# EAGLE design SenzorDPCutie (EAGLE 6.5.0)
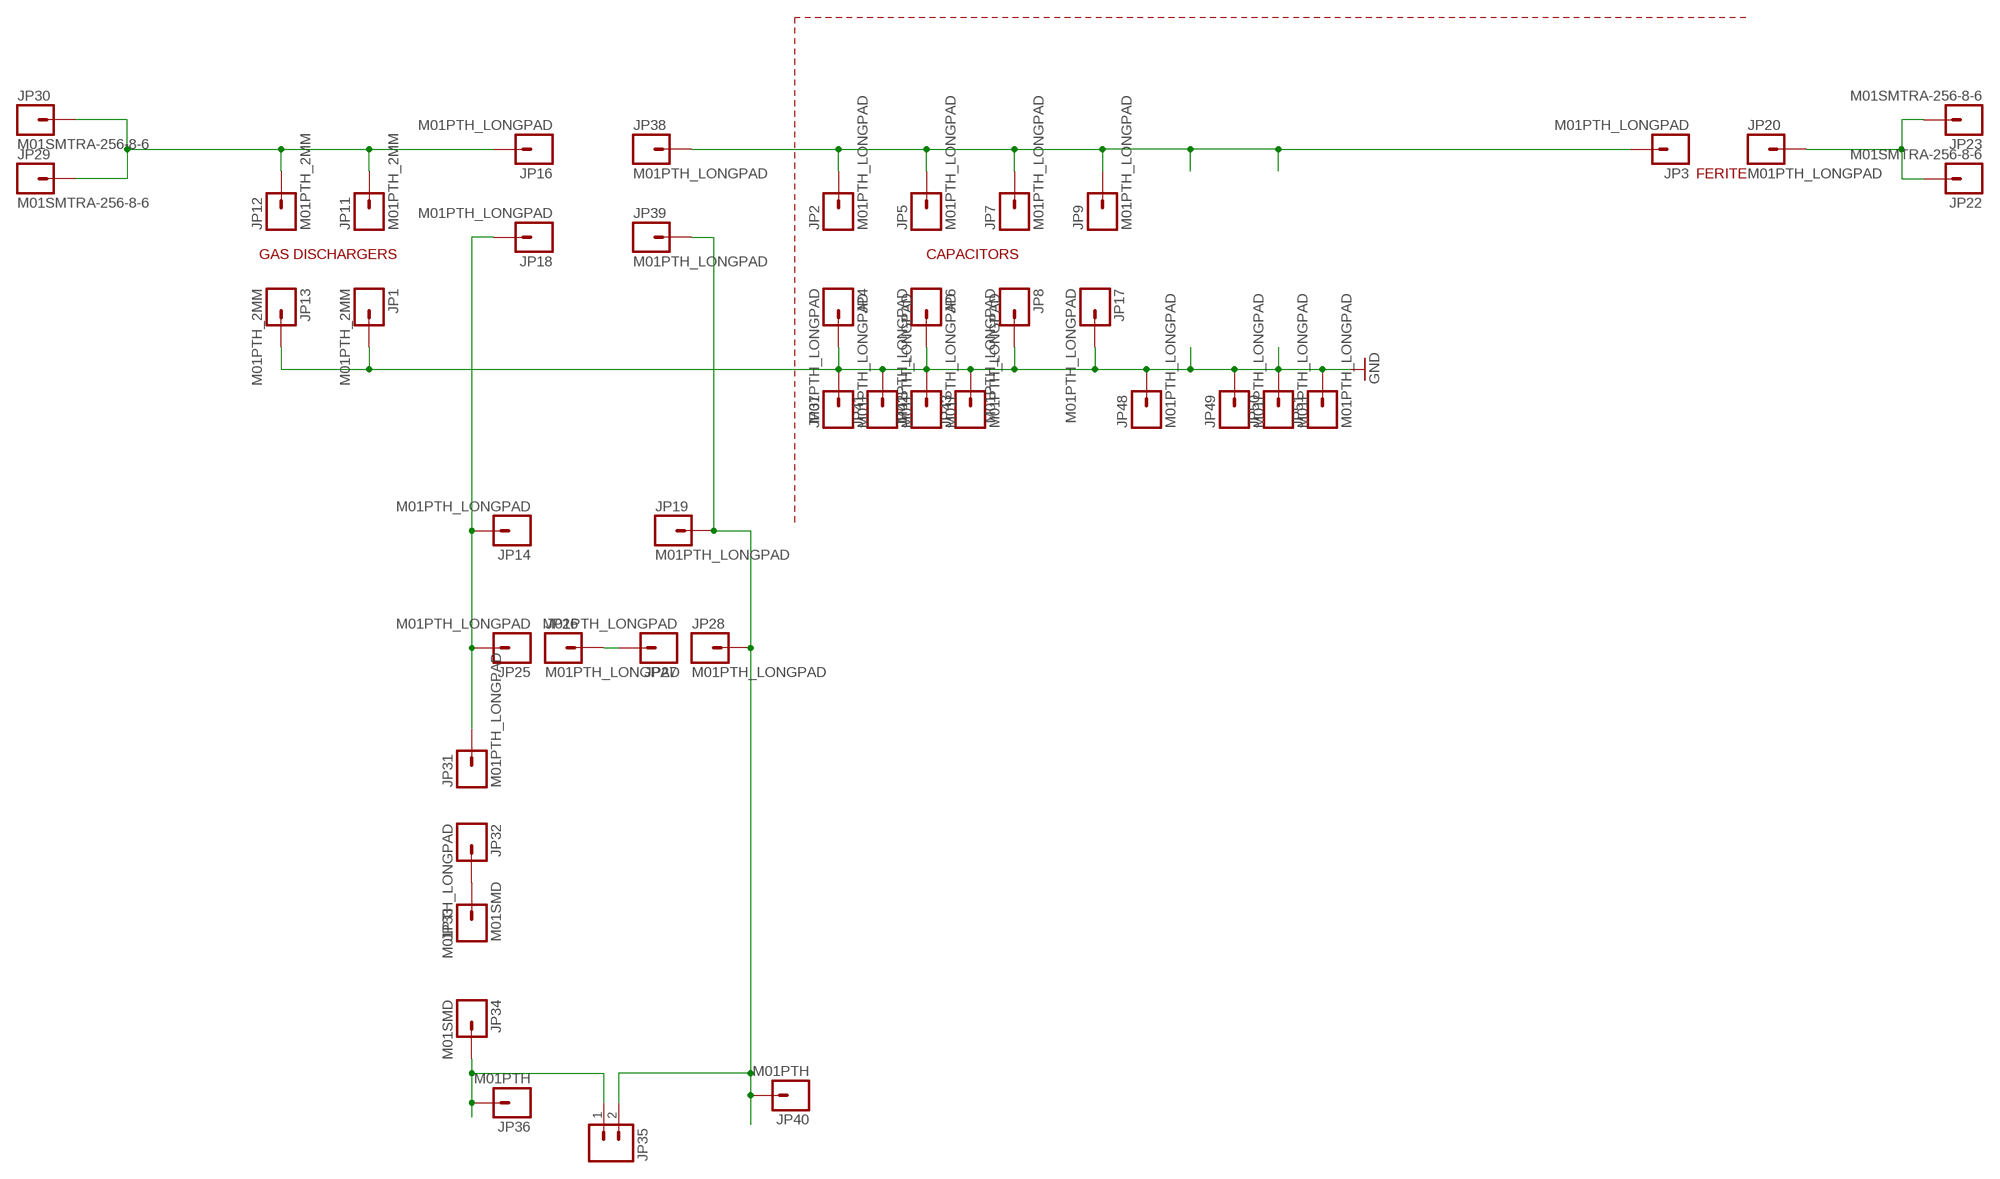
[diagram p0: schematic, sheet 1]

## Parts
JP1  M01PTH_2MM  [1X01_2MM]
JP2  M01PTH_LONGPAD  [1X01_LONGPAD]
JP3  M01PTH_LONGPAD  [1X01_LONGPAD]
JP4  M01PTH_LONGPAD  [1X01_LONGPAD]
JP5  M01PTH_LONGPAD  [1X01_LONGPAD]
JP6  M01PTH_LONGPAD  [1X01_LONGPAD]
JP7  M01PTH_LONGPAD  [1X01_LONGPAD]
JP8  M01PTH_LONGPAD  [1X01_LONGPAD]
JP9  M01PTH_LONGPAD  [1X01_LONGPAD]
JP11  M01PTH_2MM  [1X01_2MM]
JP12  M01PTH_2MM  [1X01_2MM]
JP13  M01PTH_2MM  [1X01_2MM]
JP14  M01PTH_LONGPAD  [1X01_LONGPAD]
JP16  M01PTH_LONGPAD  [1X01_LONGPAD]
JP17  M01PTH_LONGPAD  [1X01_LONGPAD]
JP18  M01PTH_LONGPAD  [1X01_LONGPAD]
JP19  M01PTH_LONGPAD  [1X01_LONGPAD]
JP20  M01PTH_LONGPAD  [1X01_LONGPAD]
JP22  M01SMTRA-256-8-6  [SMTRA-256-8-6]
JP23  M01SMTRA-256-8-6  [SMTRA-256-8-6]
JP25  M01PTH_LONGPAD  [1X01_LONGPAD]
JP26  M01PTH_LONGPAD  [1X01_LONGPAD]
JP27  M01PTH_LONGPAD  [1X01_LONGPAD]
JP28  M01PTH_LONGPAD  [1X01_LONGPAD]
JP29  M01SMTRA-256-8-6  [SMTRA-256-8-6]
JP30  M01SMTRA-256-8-6  [SMTRA-256-8-6]
JP31  M01PTH_LONGPAD  [1X01_LONGPAD]
JP32  M01PTH_LONGPAD  [1X01_LONGPAD]
JP33  M01SMD  [LUXEON-PAD]
JP34  M01SMD  [LUXEON-PAD]
JP35  M025MM  [SCREWTERMINAL-5MM-2]
JP36  M01PTH  [1X01]
JP37  M01PTH_LONGPAD  [1X01_LONGPAD]
JP38  M01PTH_LONGPAD  [1X01_LONGPAD]
JP39  M01PTH_LONGPAD  [1X01_LONGPAD]
JP40  M01PTH  [1X01]
JP41  M01PTH_LONGPAD  [1X01_LONGPAD]
JP42  M01PTH_LONGPAD  [1X01_LONGPAD]
JP43  M01PTH_LONGPAD  [1X01_LONGPAD]
JP48  M01PTH_LONGPAD  [1X01_LONGPAD]
JP49  M01PTH_LONGPAD  [1X01_LONGPAD]
JP50  M01PTH_LONGPAD  [1X01_LONGPAD]
JP51  M01PTH_LONGPAD  [1X01_LONGPAD]

## Nets
GND: JP1.1 JP4.1 JP6.1 JP8.1 JP13.1 JP17.1 JP37.1 JP41.1 JP42.1 JP43.1 JP48.1 JP49.1 JP50.1 JP51.1
N$1: JP20.1 JP22.P$1 JP23.P$1
N$2: JP26.1 JP27.1
N$4: JP32.1 JP33.P$1
N$5: JP34.P$1 JP35.1 JP36.1
N$8: JP2.1 JP3.1 JP5.1 JP7.1 JP9.1 JP38.1
N$9: JP14.1 JP18.1 JP25.1 JP31.1
N$10: JP19.1 JP28.1 JP35.2 JP39.1 JP40.1
SIG: JP11.1 JP12.1 JP16.1 JP29.P$1 JP30.P$1

## Notes on the sheet
- FERITE
- GAS DISCHARGERS | CAPACITORS

## Library data of the parts
JP1-JP9 JP11-JP14 JP16-JP20 JP22 JP23 JP25-JP34 JP36-JP43 JP48-JP51 = SparkFun-Connectors:M01: Header 1 Standard 1-pin 0.1" header. Use with straight break away headers (SKU : PRT-00116), right angle break away headers (PRT-00553), swiss pins (PRT-00743), machine pins (PRT-00117), and female headers (PRT-00115).
JP35 = SparkFun-Connectors:M02: Header 2 Standard 2-pin 0.1" header. Use with straight break away headers (SKU : PRT-00116), right angle break away headers (PRT-00553), swiss pins (PRT-00743), machine pins (PRT-00117), and female headers (PRT-00115). Molex polarized connector foot print use with SKU : PRT-08233 with associated crimp pins and housings.

## Board
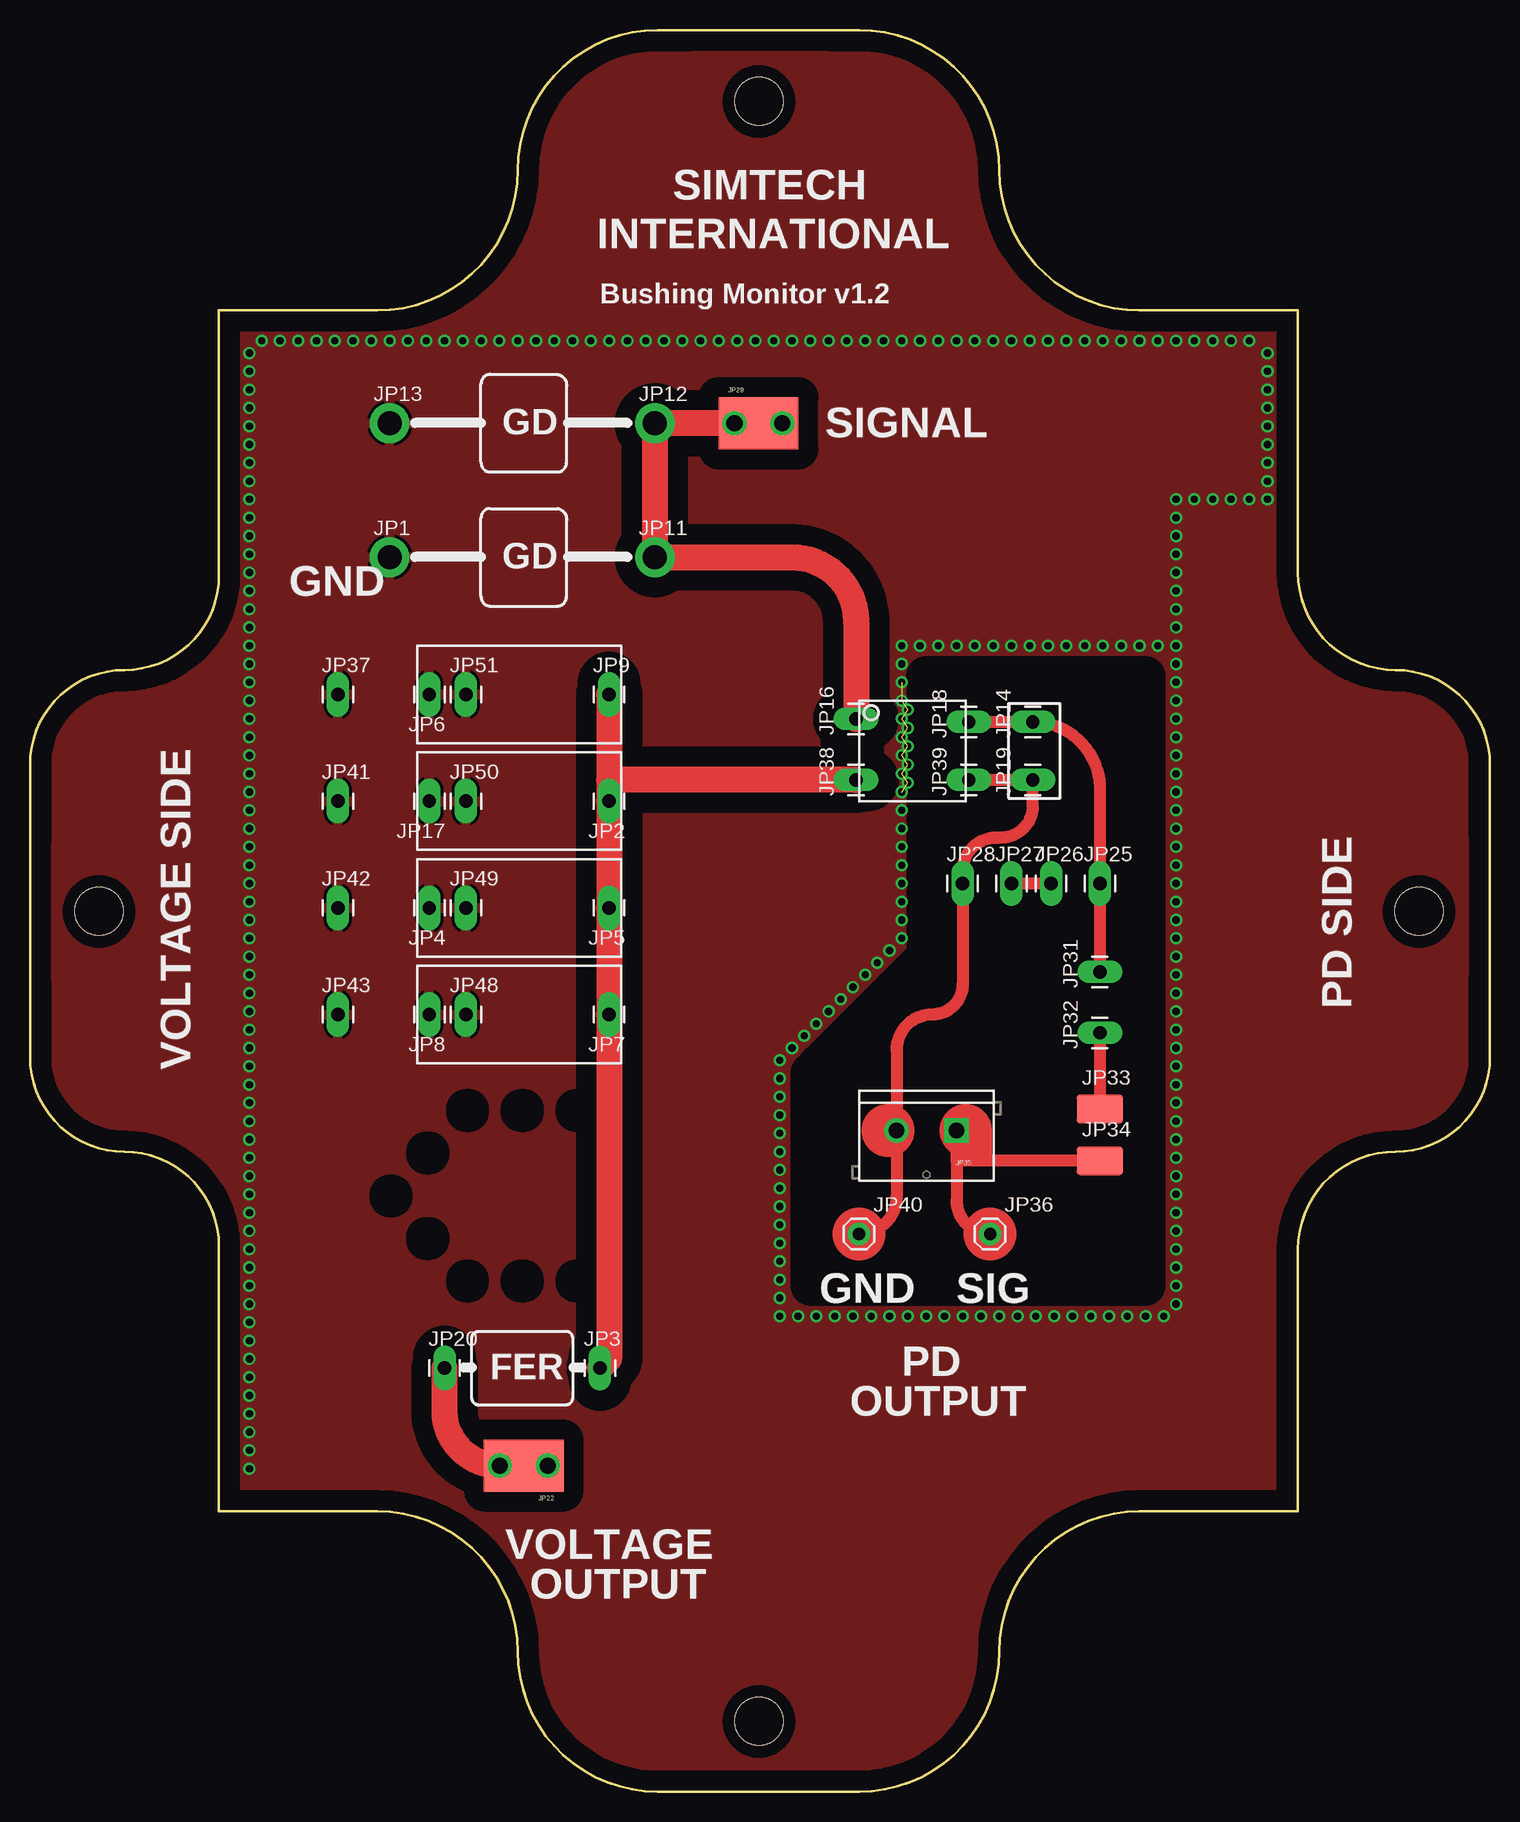
[diagram p1: board, top side]
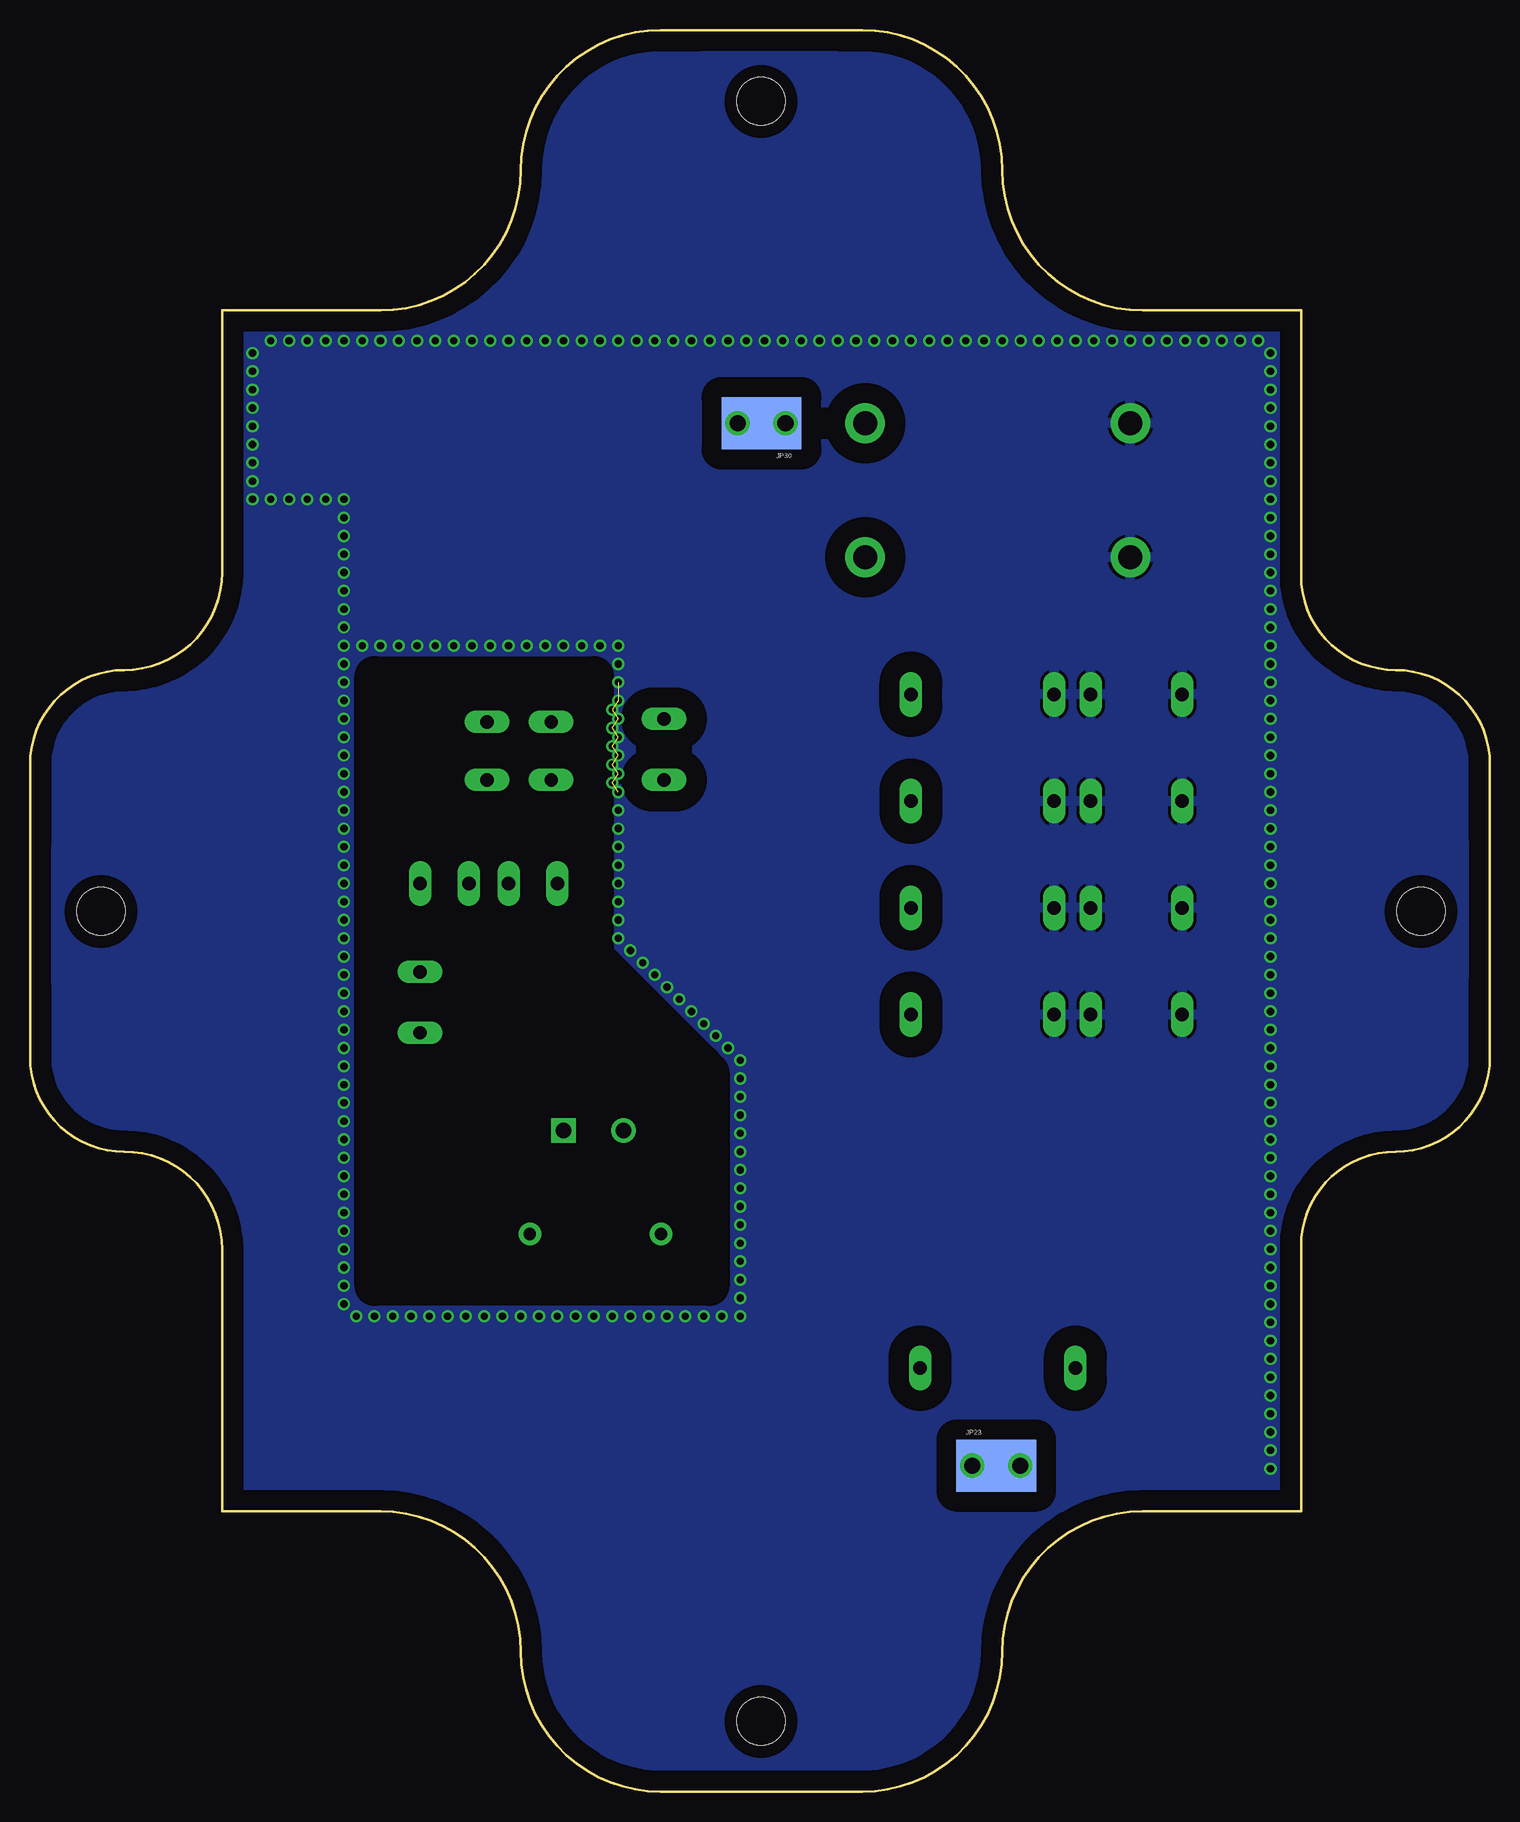
[diagram p2: board, bottom side, seen from below]

Size 121.67 x 146.81 mm. Coordinates in mm from the lower left corner, seen from the top.
Outline: 15.75,123.44 28.96,123.44 arc90 40.64,135.13 arc-90 52.32,146.81 69.09,146.81 arc-90 80.77,135.13 arc90 92.46,123.44 105.66,123.44 105.66,101.6 arc90 113.79,93.47 arc-90 121.67,85.6 121.67,61.21 arc-90 113.79,53.34 arc90 105.66,45.21 105.66,23.37 92.46,23.37 arc90 80.77,11.68 arc-90 69.09,0 52.32,0 arc-90 40.64,11.68 arc90 28.96,23.37 15.75,23.37 15.75,45.47 arc90 7.87,53.34 arc-90 0,61.21 0,85.6 arc-90 7.87,93.47 arc90 15.75,101.35 15.75,123.44
Copper layers (1*16): Top 0.035mm / dielectric 1.5mm / Bottom 0.035mm
Design rules "default *": minimum track width 10mil, minimum drill 24mil, track to track 8mil, track to pad 8mil, pad to pad 8mil, via to via 8mil, smd to smd 8mil, copper to edge 40mil, drill to drill 8mil, minimum pad ring 10mil, minimum via ring 8mil, stop-mask expansion 4mil, vias tented up to drill 0mil, thermal gap 10mil
Holes 4 mm at 60.75,140.87 5.75,73.37 115.75,73.37 60.75,5.87
tRestrict: area 65,42.2 to 93,59.9; area 74.7,58.9 to 93,93; area 33,53.1 to 33.3,53.3; area 36.3,56.6 to 36.6,56.9; area 40.9,56.6 to 41.1,56.9; area 45.5,56.6 to 45.7,56.9; area 40.9,42.4 to 41.1,42.7; area 45.5,42.4 to 45.7,42.7; area 36.3,42.4 to 36.6,42.7; area 33,46 to 33.3,46.2; area 30,49.5 to 30.2,49.8; 1 lines
bRestrict: area 65,42.2 to 93,59.9; area 74.7,58.9 to 93,93; 1 lines

### Footprints (pad centres in the part's own frame; a part is rotated, then mirrored left to right if it is on the bottom)
1X01_2MM = drill 2 pad 3.302: 1 0,0
1X01_LONGPAD = drill 1.118 pad 1.88 long: 1 0,0
SMTRA-256-8-6 = drill 1.346: P$1 -1.994,0; P$2 1.994,0 | smd 6.655 x 4.343: P$3 0,0
LUXEON-PAD = smd 3.9 x 2.4: P$1 0,0
SCREWTERMINAL-5MM-2 = drill 1.3 pad 2.032 square: 1 0,0 | drill 1.3 pad 2.032: 2 5,0
1X01 = drill 1.016 pad 1.88: 1 0,0

### Placement (x,y rotation side)
JP1  29.97,102.87 0 top
JP2  48.26,82.55 180 top
JP3  47.5,35.31 0 top
JP4  33.27,73.66 180 top
JP5  48.26,73.66 180 top
JP6  33.27,91.44 180 top
JP7  48.26,64.77 180 top
JP8  33.27,64.77 180 top
JP9  48.26,91.44 0 top
JP11  52.07,102.87 0 top
JP12  52.07,114.05 0 top
JP13  29.97,114.05 0 top
JP14  83.57,89.15 90 top
JP16  68.83,89.41 90 top
JP17  33.27,82.55 180 top
JP18  78.23,89.15 90 top
JP19  83.57,84.33 90 top
JP20  34.54,35.31 0 top
JP22  41.15,27.18 180 top
JP23  41.15,27.18 0 bottom
JP25  89.15,75.69 0 top
JP26  85.09,75.69 0 top
JP27  81.79,75.69 0 top
JP28  77.72,75.69 0 top
JP29  60.71,114.05 0 top
JP30  60.71,114.05 180 bottom
JP31  89.15,68.33 90 top
JP32  89.15,63.25 90 top
JP33  89.15,56.9 0 top
JP34  89.15,52.58 0 top
JP35  77.22,55.12 180 top
JP36  80.01,46.48 0 top
JP37  25.65,91.44 0 top
JP38  68.83,84.33 90 top
JP39  78.23,84.33 90 top
JP40  69.09,46.48 0 top
JP41  25.65,82.55 0 top
JP42  25.65,73.66 0 top
JP43  25.65,64.77 0 top
JP48  36.32,64.77 0 top
JP49  36.32,73.66 0 top
JP50  36.32,82.55 0 top
JP51  36.32,91.44 0 top

### Tracks (layer width: path | path; a pad name or v marks a point on that pad's centre or on a via)
GND  (via drill 0.6)  (11 unrouted)
  other vias: 62.48,39.62 62.48,41.15 62.48,42.67 62.48,44.2 62.48,45.72 62.48,47.24 62.48,48.77 72.64,81.79 72.64,83.31 72.64,84.84 72.64,86.36 72.64,87.88 72.64,89.41 72.64,90.93 72.64,92.46 72.64,93.98 72.64,95.5 95.5,42.16 95.5,43.69 95.5,45.21 95.5,46.74 95.5,48.26 95.5,49.78 95.5,51.31 95.5,52.83 95.5,54.36 95.5,55.88 95.5,57.4 95.5,58.93 95.5,60.45 95.5,61.98 95.5,63.5 95.5,65.02 95.5,66.55 95.5,68.07 95.5,69.6 95.5,71.12 95.5,72.64 95.5,74.17 95.5,75.69 95.5,77.22 95.5,78.74 95.5,80.26 95.5,81.79 95.5,83.31 95.5,84.84 95.5,86.36 95.5,87.88 95.5,89.41 95.5,90.93 95.5,92.46 95.5,93.98 95.5,95.5 95.5,97.03 95.5,98.55 95.5,40.64 80.77,39.62 83.82,39.62 88.39,39.62 94.49,39.62 91.44,39.62 89.92,39.62 86.87,39.62 79.25,39.62 82.3,39.62 85.34,39.62 92.96,39.62 68.58,67.06 69.6,68.07 70.61,69.09 71.63,70.1 74.17,95.5 97.03,107.7 75.69,95.5 77.22,95.5 78.74,95.5 80.26,95.5 81.79,95.5 83.31,95.5 84.84,95.5 86.36,95.5 87.88,95.5 89.41,95.5 90.93,95.5 92.46,95.5 93.98,95.5 95.5,107.7 95.5,100.08 95.5,101.6 95.5,103.12 95.5,104.65 103.12,107.7 95.5,106.17 98.55,107.7 100.08,107.7 101.6,107.7 18.29,42.16 18.29,43.69 18.29,45.21 18.29,46.74 18.29,48.26 18.29,49.78 18.29,51.31 18.29,52.83 18.29,54.36 18.29,55.88 18.29,57.4 18.29,58.93 18.29,60.45 18.29,61.98 18.29,63.5 18.29,65.02 18.29,66.55 18.29,68.07 18.29,69.6 18.29,71.12 18.29,72.64 18.29,74.17 18.29,75.69 18.29,77.22 18.29,78.74 18.29,80.26 18.29,81.79 18.29,83.31 18.29,84.84 18.29,86.36 18.29,87.88 18.29,89.41 18.29,90.93 18.29,92.46 18.29,93.98 18.29,95.5 18.29,97.03 18.29,98.55 18.29,33.02 18.29,36.07 18.29,37.59 18.29,39.12 18.29,40.64 18.29,34.54 84.84,120.9 80.26,120.9 81.79,120.9 74.17,120.9 83.31,120.9 86.36,120.9 87.88,120.9 89.41,120.9 90.93,120.9 92.46,120.9 93.98,120.9 95.5,120.9 72.64,120.9 71.12,120.9 69.6,120.9 68.07,120.9 78.74,120.9 77.22,120.9 75.69,120.9 40.64,120.9 36.07,120.9 37.59,120.9 29.97,120.9 39.12,120.9 42.16,120.9 43.69,120.9 45.21,120.9 46.74,120.9 48.26,120.9 49.78,120.9 51.31,120.9 52.83,120.9 28.45,120.9 26.92,120.9 25.4,120.9 34.54,120.9 33.02,120.9 31.5,120.9 103.12,109.22 103.12,110.74 103.12,112.27 103.12,113.79 18.29,100.08 18.29,101.6 18.29,103.12 18.29,104.65 18.29,106.17 18.29,107.7 18.29,109.22 18.29,110.74 18.29,112.27 18.29,113.79 66.55,120.9 65.02,120.9 63.5,120.9 61.98,120.9 60.45,120.9 58.93,120.9 57.4,120.9 55.88,120.9 54.36,120.9 18.29,31.5 18.29,29.97 18.29,28.45 18.29,26.92 97.03,120.9 98.55,120.9 100.08,120.9 101.6,120.9 103.12,115.32 103.12,116.84 103.12,118.36 103.12,119.89 18.29,115.32 18.29,116.84 18.29,118.36 18.29,119.89 23.88,120.9 22.35,120.9 20.83,120.9 19.3,120.9 62.48,50.29 62.48,51.82 62.48,53.34 62.48,54.86 62.48,56.39 62.48,57.91 62.48,59.44 62.48,60.96 67.56,66.04 72.64,71.12 72.64,72.64 72.64,74.17 72.64,75.69 72.64,77.22 72.64,78.74 72.64,80.26 66.55,65.02 65.53,64.01 64.52,62.99 63.5,61.98 64.01,39.62 65.53,39.62 67.06,39.62 68.58,39.62 70.1,39.62 71.63,39.62 73.15,39.62 74.68,39.62 76.2,39.62 77.72,39.62 73.15,90.17 73.15,88.65 73.15,87.12 73.15,85.6 73.15,84.07
  pour Bottom (isolate 1.676): -1.02,147.83 122.43,147.83 122.43,-0.25 -1.02,-0.51
  pour Top (isolate 1.676): -1.02,147.7 122.43,147.7 122.43,-0.38 -1.02,-0.38
  pour Bottom (no thermals): 54.36,145.03 54.36,135.64 65.79,135.64 65.79,145.03
  pour Top (no thermals): 55.12,135.64 55.12,145.03 66.55,145.03 66.55,135.64
  pour Bottom (no thermals): 11.43,79.25 1.78,79.25 1.78,67.82 11.43,67.82
  pour Top (no thermals): 1.78,78.99 11.18,78.99 11.18,67.56 1.78,67.56
  pour Bottom (no thermals): 55.12,11.18 55.12,1.78 66.55,1.78 66.55,11.18
  pour Top (no thermals): 66.04,11.18 66.04,1.78 54.61,1.78 54.61,11.18
  pour Bottom (no thermals): 119.89,78.74 110.49,78.74 110.49,67.31 119.89,67.31
  pour Top (no thermals): 110.49,79.5 119.89,79.5 119.89,68.07 110.49,68.07
N$1  (via drill 0.8)
  Top 2.184: v39.12,27.18 arc-90 34.54,31.75 JP20.1
  Bottom 2.184: v39.12,27.18 JP22.P$1
N$2
  Top 1.016: JP27.1 JP26.1
N$4
  Top 1.016: JP32.1 JP33.P$1
N$5
  Top 1.016: JP35.1 77.22,54.61 77.22,52.58 | 77.22,52.58 77.22,49.28 arc90 JP36.1 | JP34.P$1 77.22,52.58
N$8
  Top 2.184: JP9.1 48.26,84.33 | 48.26,84.33 JP2.1 JP5.1 JP7.1 48.26,36.07 JP3.1 | JP38.1 48.26,84.33
N$9
  Top 1.016: JP18.1 JP14.1 arc-90 89.15,83.57 JP25.1 JP31.1
N$10
  Top 1.016: JP39.1 JP19.1 83.57,82.04 arc-90 80.77,79.5 arc90 77.72,76.96 JP28.1 77.72,67.31 arc-90 75.18,64.77 arc90 72.22,61.8 JP35.2 72.22,49.61 arc-90 JP40.1
SIG
  Top 2.184: JP29.P$1 JP12.1 JP11.1 63.5,102.87 arc-90 68.83,97.54 JP16.1
(copper drawn outside any net)
  shapes: Top area x1, Top circle x4

### Text on the board
tPlace: SIMTECH | INTERNATIONAL | Bushing Monitor v1.2 | GD | SIGNAL | GD | GND | PD SIDE | VOLTAGE SIDE | GND | SIG | PD | FER | OUTPUT | VOLTAGE | OUTPUT